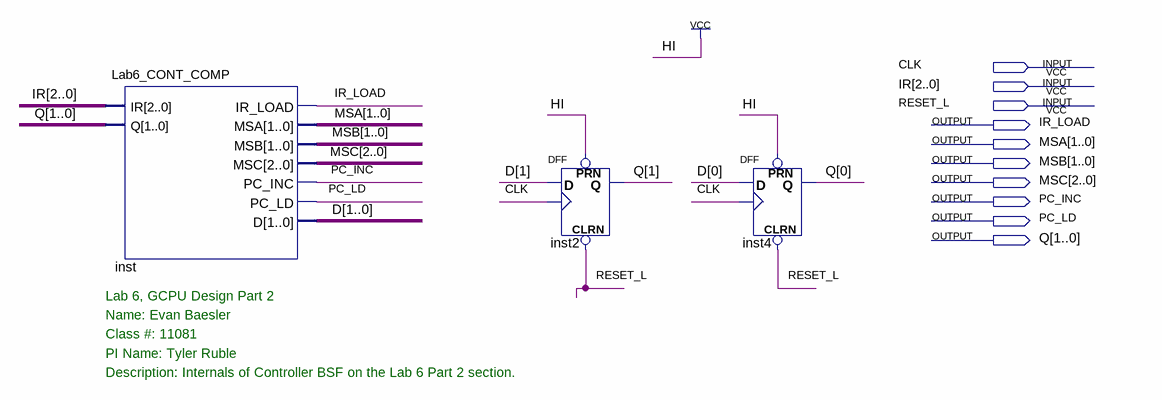
[diagram p0: schematic sheet]
// Quartus schematic Lab6_PART2_CONT.bdf as structural Verilog: 3 symbols, 10 pins
module Lab6_PART2_CONT (
  input  CLK,
  input  [2:0] IR,
  input  RESET_L,
  output IR_LOAD,
  output [1:0] MSA,
  output [1:0] MSB,
  output [2:0] MSC,
  output PC_INC,
  output PC_LD,
  output [1:0] Q
);

  wire [1:0] D;

  Lab6_CONT_COMP inst (
    .IR(IR), .Q(Q), .IR_LOAD(IR_LOAD), .MSA(MSA), .MSB(MSB), .MSC(MSC), .PC_INC(PC_INC), .PC_LD(PC_LD), .D(D));
  DFF inst2 (.CLRN(RESET_L), .CLK(CLK), .D(D[1]), .PRN(1'b1), .Q(Q[1]));
  DFF inst4 (.CLRN(RESET_L), .CLK(CLK), .D(D[0]), .PRN(1'b1), .Q(Q[0]));

  // Notes on the sheet:
  //   Lab 6, GCPU Design Part 2
  //   Name: Evan Baesler
  //   Class #: 11081
  //   PI Name: Tyler Ruble
  //   Description: Internals of Controller BSF on the Lab 6 Part 2 section.
endmodule
